# Altium schematic sheet Cargador.SchDoc
size A4; SheetNumber: 4; SheetTotal: 5; SPICEModelCacheMPYIFOMC: <root> / <DocumentId>MPYIFOMC</DocumentId> / </root>
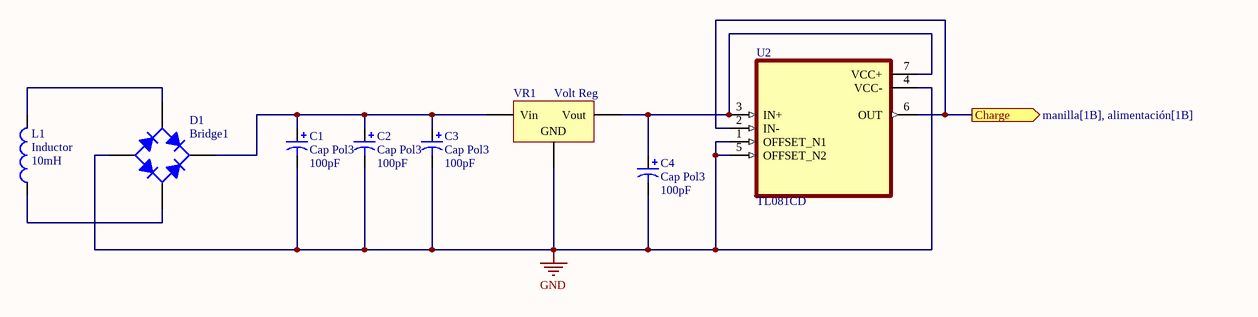
[diagram p0: Cargador.SchDoc]

## Parts
C1  Cap Pol3  value 100pF  [C0805]
C2  Cap Pol3  value 100pF  [C0805]
C3  Cap Pol3  value 100pF  [C0805]
C4  Cap Pol3  value 100pF  [C0805]
D1  Bridge1  [D-38]
L1  Inductor  value 10mH  [0402-A]
U2  TL081CD  [SOIC127P599X175-8N]
VR1  Volt Reg  [D2PAK_M]

## Ports
Charge (out, see manilla[1B], alimentación[1B])

## Nets
GND: C1.2 C2.2 C3.2 C4.2 D1.3(A) U2.1(OFFSET_N1) U2.4(VCC-) U2.5(OFFSET_N2) VR1.2(GND)
Charge: U2.2(IN-) U2.6(OUT) ; port Charge
NetC1_1: C1.1 C2.1 C3.1 D1.1(K) VR1.1(Vin)
NetC4_1: C4.1 U2.3(IN+) U2.7(VCC+) VR1.3(Vout)
NetD1_2: D1.2(C) L1.1
NetD1_4: D1.4(C) L1.2

## Library data of the parts
C1-C4 = Cap Pol3: Polarized Capacitor (Surface Mount); Published: 8-Jun-2000; LatestRevisionDate: 29-May-2009; LatestRevisionNote: IPC-7351 Footprint Added.; PackageReference: C0805; Publisher: Altium Limited; PackageDescription: Chip Capacitor
D1 = Bridge1: Full Wave Diode Bridge; Published: 8-Jun-2000; LatestRevisionDate: 29-May-2009; LatestRevisionNote: Sch pins A & K swapped.; DatasheetVersion: E2732B; PackageReference: D-38; Publisher: Altium Limited; PackageDescription: Bridge Rectifier; 4 Terminals; Body 9.4 x 9.4 mm (typ); Pitch 5.08 mm
L1 = Inductor: Code_IEC: 1005; Published: 8-Jun-2000; LatestRevisionDate: 29-May-2009; LatestRevisionNote: IPC-7351 Footprint Added.; PackageReference: 0402-A; Publisher: Altium Limited; PackageDescription: Chip Inductor; Code_JEITA: 0402
U2 = TL081CD: High Slew Rate JFET-Input Operational Amplifier 8-SOIC 0 to 70; MF: Texas Instruments; Package: SOIC-8 Texas Instruments; SnapEDA_Link: https://www.snapeda.com/parts/TL081CD/Texas%20Instruments/view-part/4793911/?ref=snap; MP: TL081CD; Availability: Good; Price: None; Value: *; Purchase-URL: https://pricing.snapeda.com/search/part/TL081CD/?ref=eda
VR1 = Volt Reg: Voltage Regulator; Published: 24-Mar-1999; LatestRevisionDate: 29-May-2009; LatestRevisionNote: IPC-7351 Footprint Added.; PackageReference: D2PAK; Publisher: Altium Limited; PackageDescription: 3-Pin Transistor Outline Package 2.54 mm Pitch, 15.1 mm Lead Span